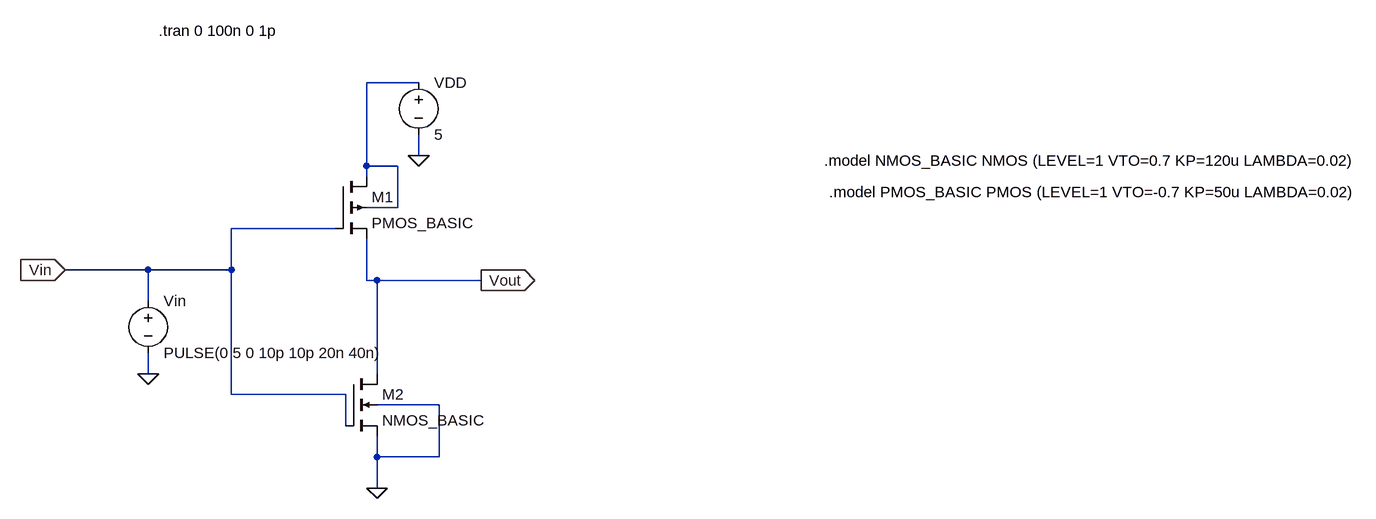
[diagram p0: schematic cmos.asc]
cmos.asc, the LTspice schematic file:
Version 4.1
SHEET 1 1668 680
WIRE 192 16 112 16
WIRE 192 128 192 96
WIRE 112 144 112 16
WIRE 160 144 112 144
WIRE 112 160 112 144
WIRE 160 208 160 144
WIRE 160 208 112 208
WIRE 64 240 -96 240
WIRE -224 304 -352 304
WIRE -96 304 -96 240
WIRE -96 304 -224 304
WIRE 112 320 112 256
WIRE 128 320 112 320
WIRE 288 320 128 320
WIRE -224 352 -224 304
WIRE -224 464 -224 432
WIRE 128 464 128 320
WIRE -96 496 -96 304
WIRE 80 496 -96 496
WIRE 224 512 128 512
WIRE 80 544 80 496
WIRE 128 592 128 560
WIRE 224 592 224 512
WIRE 224 592 128 592
WIRE 128 640 128 592
FLAG 192 128 0
FLAG -224 464 0
FLAG 128 640 0
FLAG 288 320 Vout
IOPIN 288 320 Out
FLAG -352 304 Vin
IOPIN -352 304 In
SYMBOL pmos4 64 160 R0
SYMATTR InstName M1
SYMATTR Value PMOS_BASIC
SYMBOL voltage 192 0 R0
SYMATTR InstName VDD
SYMATTR Value 5
SYMBOL voltage -224 336 R0
WINDOW 123 0 0 Left 0
WINDOW 39 0 0 Left 0
SYMATTR InstName Vin
SYMATTR Value PULSE(0 5 0 10p 10p 20n 40n)
SYMBOL nmos4 80 464 R0
SYMATTR InstName M2
SYMATTR Value NMOS_BASIC
TEXT 816 136 Left 2 !.model NMOS_BASIC NMOS (LEVEL=1 VTO=0.7 KP=120u LAMBDA=0.02)
TEXT 824 184 Left 2 !.model PMOS_BASIC PMOS (LEVEL=1 VTO=-0.7 KP=50u LAMBDA=0.02)
TEXT -208 -64 Left 2 !.tran 0 100n 0 1p

The netlist it stands for:
* cmos.asc
M1 N001 Vin Vout N001 PMOS_BASIC
VDD N001 0 5
Vin Vin 0 PULSE(0 5 0 10p 10p 20n 40n)
M2 Vout Vin 0 0 NMOS_BASIC
.model NMOS NMOS
.model PMOS PMOS
.lib standard.mos
.model NMOS_BASIC NMOS (LEVEL=1 VTO=0.7 KP=120u LAMBDA=0.02)
.model PMOS_BASIC PMOS (LEVEL=1 VTO=-0.7 KP=50u LAMBDA=0.02)
.tran 0 100n 0 1p
.backanno
.end